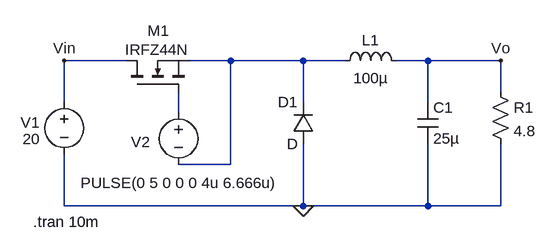
[diagram p0: schematic Analisis_BUCK_Ideal.asc]
Analisis_BUCK_Ideal.asc, the LTspice schematic file:
Version 4
SHEET 1 880 680
WIRE 128 64 32 64
WIRE 288 64 224 64
WIRE 400 64 288 64
WIRE 464 64 400 64
WIRE 592 64 544 64
WIRE 704 64 592 64
WIRE 704 112 704 64
WIRE 32 128 32 64
WIRE 400 128 400 64
WIRE 592 128 592 64
WIRE 208 144 208 112
WIRE 288 224 288 64
WIRE 288 224 208 224
WIRE 32 288 32 208
WIRE 400 288 400 192
WIRE 400 288 32 288
WIRE 592 288 592 192
WIRE 592 288 400 288
WIRE 704 288 704 192
WIRE 704 288 592 288
FLAG 400 288 0
FLAG 704 64 Vo
FLAG 32 64 Vin
SYMBOL voltage 32 112 R0
WINDOW 123 0 0 Left 0
WINDOW 39 0 0 Left 0
WINDOW 0 -67 47 Left 2
WINDOW 3 -64 73 Left 2
SYMATTR InstName V1
SYMATTR Value 20
SYMBOL nmos 128 112 R270
WINDOW 0 94 32 VRight 2
WINDOW 3 65 -2 VRight 2
SYMATTR InstName M1
SYMATTR Value IRFZ44N
SYMBOL ind 448 80 R270
WINDOW 0 32 56 VTop 2
WINDOW 3 5 56 VBottom 2
SYMATTR InstName L1
SYMATTR Value 100µ
SYMBOL diode 416 192 R180
WINDOW 0 24 64 Left 2
WINDOW 3 24 0 Left 2
SYMATTR InstName D1
SYMBOL cap 576 128 R0
SYMATTR InstName C1
SYMATTR Value 25µ
SYMBOL res 688 96 R0
SYMATTR InstName R1
SYMATTR Value 4.8
SYMBOL voltage 208 128 R0
WINDOW 3 -151 124 Left 2
WINDOW 123 0 0 Left 0
WINDOW 39 0 0 Left 0
WINDOW 0 -73 61 Left 2
SYMATTR Value PULSE(0 5 0 0 0 4u 6.666u)
SYMATTR InstName V2
TEXT -16 312 Left 2 !.tran 10m

The netlist it stands for:
* Analisis_BUCK_Ideal.asc
V1 Vin 0 20
M1 Vin N002 N001 N001 IRFZ44N
L1 N001 Vo 100µ
D1 0 N001 D
C1 Vo 0 25µ
R1 Vo 0 4.8
V2 N002 N001 PULSE(0 5 0 0 0 4u 6.666u)
.model D D
.lib standard.dio
.model NMOS NMOS
.model PMOS PMOS
.lib standard.mos
.tran 10m
.backanno
.end